# Altium schematic sheet STM32.SchDoc: STM32
size A3; DocumentNumber: 12; Revision: 1.8.2; SheetNumber: 12; SheetTotal: 19
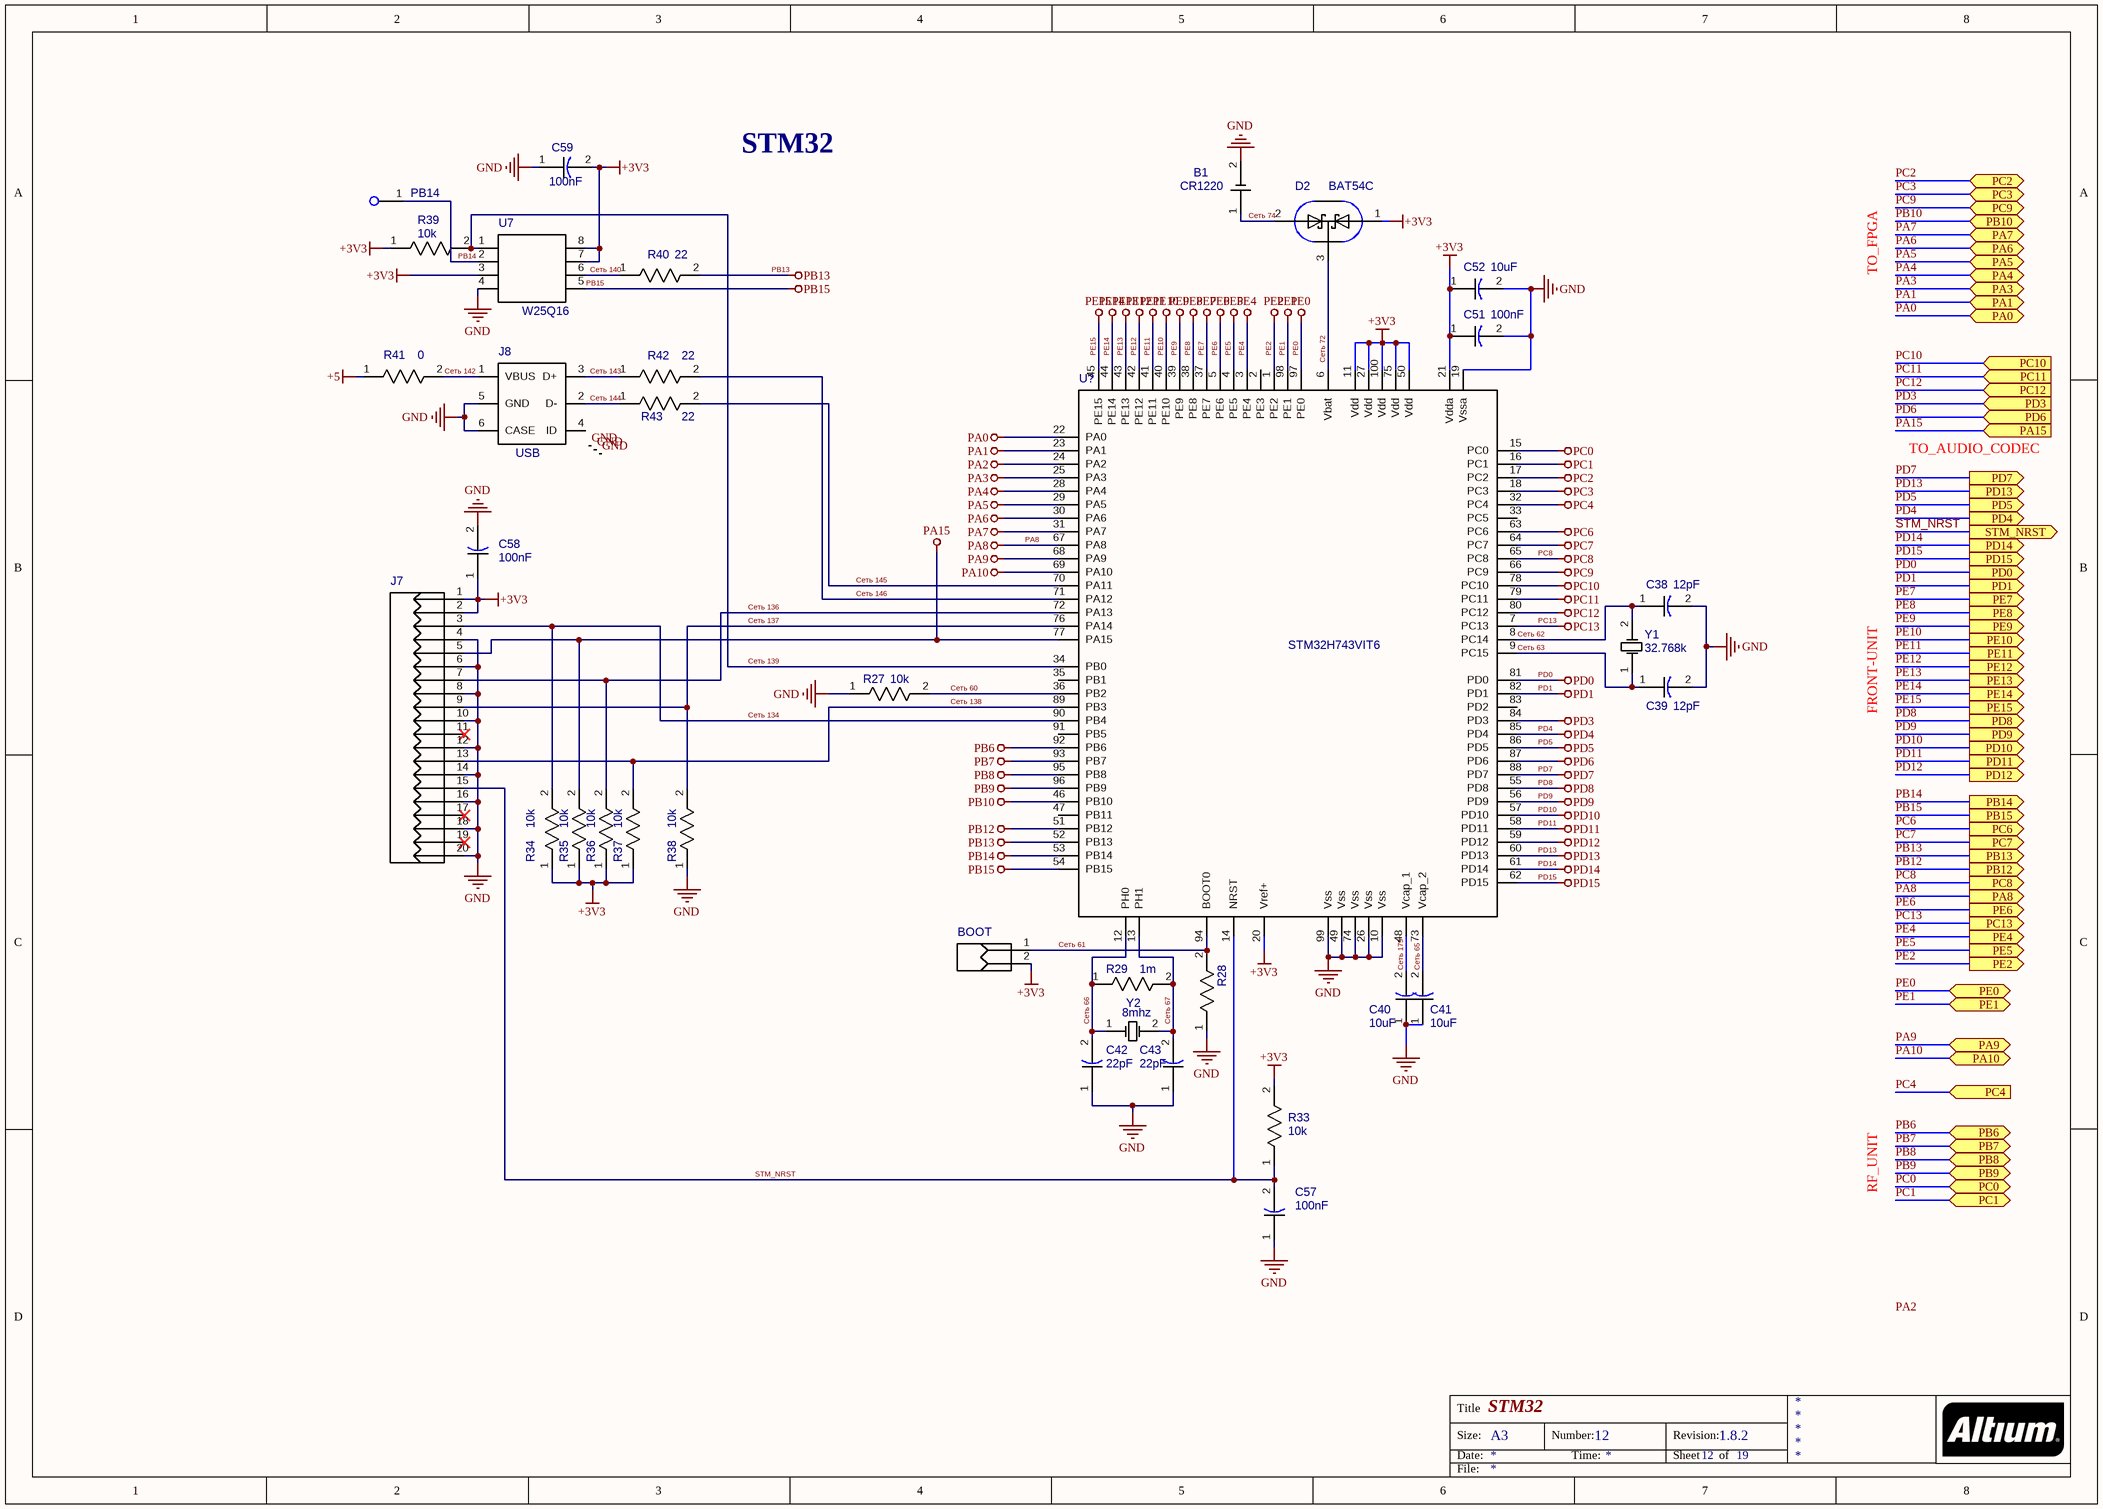
[diagram p0: STM32.SchDoc]

## Parts
B1  CR1220  [BR1632A/FA]
BOOT  (no value)  [51022-0200]
C38  12pF  [CAP_0805]
C39  12pF  [CAP_0805]
C40  10uF  [CAP_0805]
C41  10uF  [CAP_0805]
C42  22pF  [CAP_0805]
C43  22pF  [CAP_0805]
C51  100nF  [CAP_0805]
C52  10uF  [CAP_0805]
C57  100nF  [CAP_0805]
C58  100nF  [CAP_0805]
C59  100nF  [CAP_0805]
D2  BAT54C  [BAT54C]
J7  JTAG_STM32  [90131-0130]  (value not drawn)
J8  USB  [2-1734035-3]
NetPort?  PB14  (graphical)
R27  10k  [RES_0805]
R28  10k  [RES_0805]  (value not drawn)
R29  1m  [RES_0805]
R33  10k  [RES_0805]
R34  10k  [RES_0805]
R35  10k  [RES_0805]
R36  10k  [RES_0805]
R37  10k  [RES_0805]
R38  10k  [RES_0805]
R39  10k  [RES_0805]
R40  22  [RES_0805]
R41  0  [RES_0805]
R42  22  [RES_0805]
R43  22  [RES_0805]
U7  W25Q16  [W25Q16]
U?  STM32H743VIT6  [STM32H743VIT6]
Y1  32.768k  [R26-32.768]
Y2  8mhz  [ECS-200-20-1]

## Ports
PA0 (bidir), PA1 (bidir), PA3 (bidir), PA4 (bidir), PA5 (bidir), PA6 (bidir), PA7 (bidir), PA8 (out), PA9 (bidir), PA10 (bidir), PA15 (in), PB6 (bidir), PB7 (bidir), PB8 (bidir), PB9 (bidir), PB10 (bidir), PB12 (out), PB13 (out), PB14 (out), PB15 (out), PC0 (bidir), PC1 (bidir), PC2 (bidir), PC3 (bidir), PC4 (in), PC6 (out), PC7 (out), PC8 (out), PC9 (bidir), PC10 (in), PC11 (in), PC12 (in), PC13 (out), PD0 (out), PD1 (out), PD3 (in), PD4 (out), PD5 (out), PD6 (in), PD7 (out), PD8 (out), PD9 (out), PD10 (out), PD11 (out), PD12 (out), PD13 (out), PD14 (out), PD15 (out), PE0 (bidir), PE1 (bidir), PE2 (out), PE4 (out), PE5 (out), PE6 (out), PE7 (out), PE8 (out), PE9 (out), PE10 (out), PE11 (out), PE12 (out), PE13 (out), PE14 (out), PE15 (out), STM_NRST (out)

## Nets
+3V3: BOOT.2 C51.1 C52.1 C58.1 C59.2 D2.1((A1)) J7.1(P1) J7.2(P2) R33.2 R34.1 R35.1 R36.1 R37.1 R39.1 U7.3(WP) U7.7(HOLD) U7.8(VCC) U?.11(Vdd) U?.20(Vref+) U?.21(Vdda) U?.27(Vdd) U?.50(Vdd) U?.75(Vdd) U?.100(Vdd)
+5: R41.1
GND: B1.2(NEG) C38.2 C39.2 C40.1 C41.1 C42.1 C43.1 C51.2 C52.2 C57.1 C58.2 C59.1 J7.4(P4) J7.6(P6) J7.8(P8) J7.10(P10) J7.12(P12) J7.14(P14) J7.16(P16) J7.18(P18) J7.20(P20) J8.5(GND) J8.6(CASE) J8.7 J8.8 J8.9 R27.1 R28.1 R38.1 U7.4(GND) U?.10(Vss) U?.19(Vssa) U?.26(Vss) U?.49(Vss) U?.74(Vss) U?.99(Vss)
PA0: U?.22(PA0) ; port PA0
PA1: U?.23(PA1) ; port PA1
PA2: U?.24(PA2)
PA3: U?.25(PA3) ; port PA3
PA4: U?.28(PA4) ; port PA4
PA5: U?.29(PA5) ; port PA5
PA6: U?.30(PA6) ; port PA6
PA7: U?.31(PA7) ; port PA7
PA8: U?.67(PA8) ; port PA8
PA9: U?.68(PA9) ; port PA9
PA10: U?.69(PA10) ; port PA10
PA15: J7.5(P5) R35.2 U?.77(PA15) ; port PA15
PB6: U?.92(PB6) ; port PB6
PB7: U?.93(PB7) ; port PB7
PB8: U?.95(PB8) ; port PB8
PB9: U?.96(PB9) ; port PB9
PB10: U?.46(PB10) ; port PB10
PB12: U?.51(PB12) ; port PB12
PB13: R40.2 U?.52(PB13) ; port PB13
PB14: NetPort?.1 U7.2(SO) U?.53(PB14) ; port PB14
PB15: U7.5(SI) U?.54(PB15) ; port PB15
PC0: U?.15(PC0) ; port PC0
PC1: U?.16(PC1) ; port PC1
PC2: U?.17(PC2) ; port PC2
PC3: U?.18(PC3) ; port PC3
PC4: U?.32(PC4) ; port PC4
PC6: U?.63(PC6) ; port PC6
PC7: U?.64(PC7) ; port PC7
PC8: U?.65(PC8) ; port PC8
PC9: U?.66(PC9) ; port PC9
PC10: U?.78(PC10) ; port PC10
PC11: U?.79(PC11) ; port PC11
PC12: U?.80(PC12) ; port PC12
PC13: U?.7(PC13) ; port PC13
PD0: U?.81(PD0) ; port PD0
PD1: U?.82(PD1) ; port PD1
PD3: U?.84(PD3) ; port PD3
PD4: U?.85(PD4) ; port PD4
PD5: U?.86(PD5) ; port PD5
PD6: U?.87(PD6) ; port PD6
PD7: U?.88(PD7) ; port PD7
PD8: U?.55(PD8) ; port PD8
PD9: U?.56(PD9) ; port PD9
PD10: U?.57(PD10) ; port PD10
PD11: U?.58(PD11) ; port PD11
PD12: U?.59(PD12) ; port PD12
PD13: U?.60(PD13) ; port PD13
PD14: U?.61(PD14) ; port PD14
PD15: U?.62(PD15) ; port PD15
PE0: U?.97(PE0) ; port PE0
PE1: U?.98(PE1) ; port PE1
PE2: U?.1(PE2) ; port PE2
PE4: U?.3(PE4) ; port PE4
PE5: U?.4(PE5) ; port PE5
PE6: U?.5(PE6) ; port PE6
PE7: U?.37(PE7) ; port PE7
PE8: U?.38(PE8) ; port PE8
PE9: U?.39(PE9) ; port PE9
PE10: U?.40(PE10) ; port PE10
PE11: U?.41(PE11) ; port PE11
PE12: U?.42(PE12) ; port PE12
PE13: U?.43(PE13) ; port PE13
PE14: U?.44(PE14) ; port PE14
PE15: U?.45(PE15) ; port PE15
STM_NRST: C57.2 J7.15(P15) R33.1 U?.14(NRST) ; port STM_NRST
Сеть 60: R27.2 U?.36(PB2)
Сеть 61: BOOT.1 R28.2 U?.94(BOOT0)
Сеть 62: C38.1 U?.8(PC14) Y1.2(OSC2)
Сеть 63: C39.1 U?.9(PC15) Y1.1(OSC1)
Сеть 65: C41.2 U?.73(Vcap_2)
Сеть 66: C42.2 R29.1 U?.12(PH0) Y2.1(OSC1)
Сеть 67: C43.2 R29.2 U?.13(PH1) Y2.2(OSC2)
Сеть 72: D2.3((K1),(K2)) U?.6(Vbat)
Сеть 74: B1.1(POS) D2.2((A2))
Сеть 134: J7.3(P3) R34.2 U?.90(PB4)
Сеть 136: J7.7(P7) R36.2 U?.72(PA13)
Сеть 137: J7.9(P9) R38.2 U?.76(PA14)
Сеть 138: J7.13(P13) R37.2 U?.89(PB3)
Сеть 139: R39.2 U7.1(CS) U?.34(PB0)
Сеть 140: R40.1 U7.6(CLK)
Сеть 142: J8.1(VBUS) R41.2
Сеть 143: J8.3(D+) R42.1
Сеть 144: J8.2(D-) R43.1
Сеть 145: R43.2 U?.70(PA11)
Сеть 146: R42.2 U?.71(PA12)
Сеть 179: C40.2 U?.48(Vcap_1)

Not connected (* = marked no-connect by the designer): J7 11(P11)* 17(P17)* 19(P19)*; J8 4(ID); U? 2(PE3) 33(PC5) 35(PB1) 47(PB11) 83(PD2) 91(PB5)

## Notes on the sheet
- STM32
- TO_FPGA
- TO_AUDIO_CODEC
- FRONT-UNIT
- RF_UNIT
- Labels drawn without touching a wire or pin: PA2
- Title
- Size:
- Date:
- A3
- Number:
- Time:
- Revision:
- Sheet
- of
- File:

## Library data of the parts
B1 = BR1632A/FA: Value: CR1220
BOOT = 51022-0200
C38-C43 C51 C52 C57-C59 = CAP_0805
  C38 C39: Value: 12pF
  C40 C41 C52: Value: 10uF
  C42 C43: Value: 22pF
  C51 C57-C59: Value: 100nF
J7 = 90131-0130: Value: JTAG_STM32
J8 = 2-1734035-3: Value: USB
R27-R29 R33-R43 = RES_0805
  R27 R28 R33-R39: Value: 10k
  R29: Value: 1m
  R40 R42 R43: Value: 22
  R41: Value: 0
Y1 = R26-32.768: Value: 32.768k
Y2 = ECS-200-20-1: Value: 8mhz
D2 = BAT54C: Value: BAT54C
U7 = W25Q16: Value: W25Q16
U? = STM32H743VIT6: Value: STM32H743VIT6